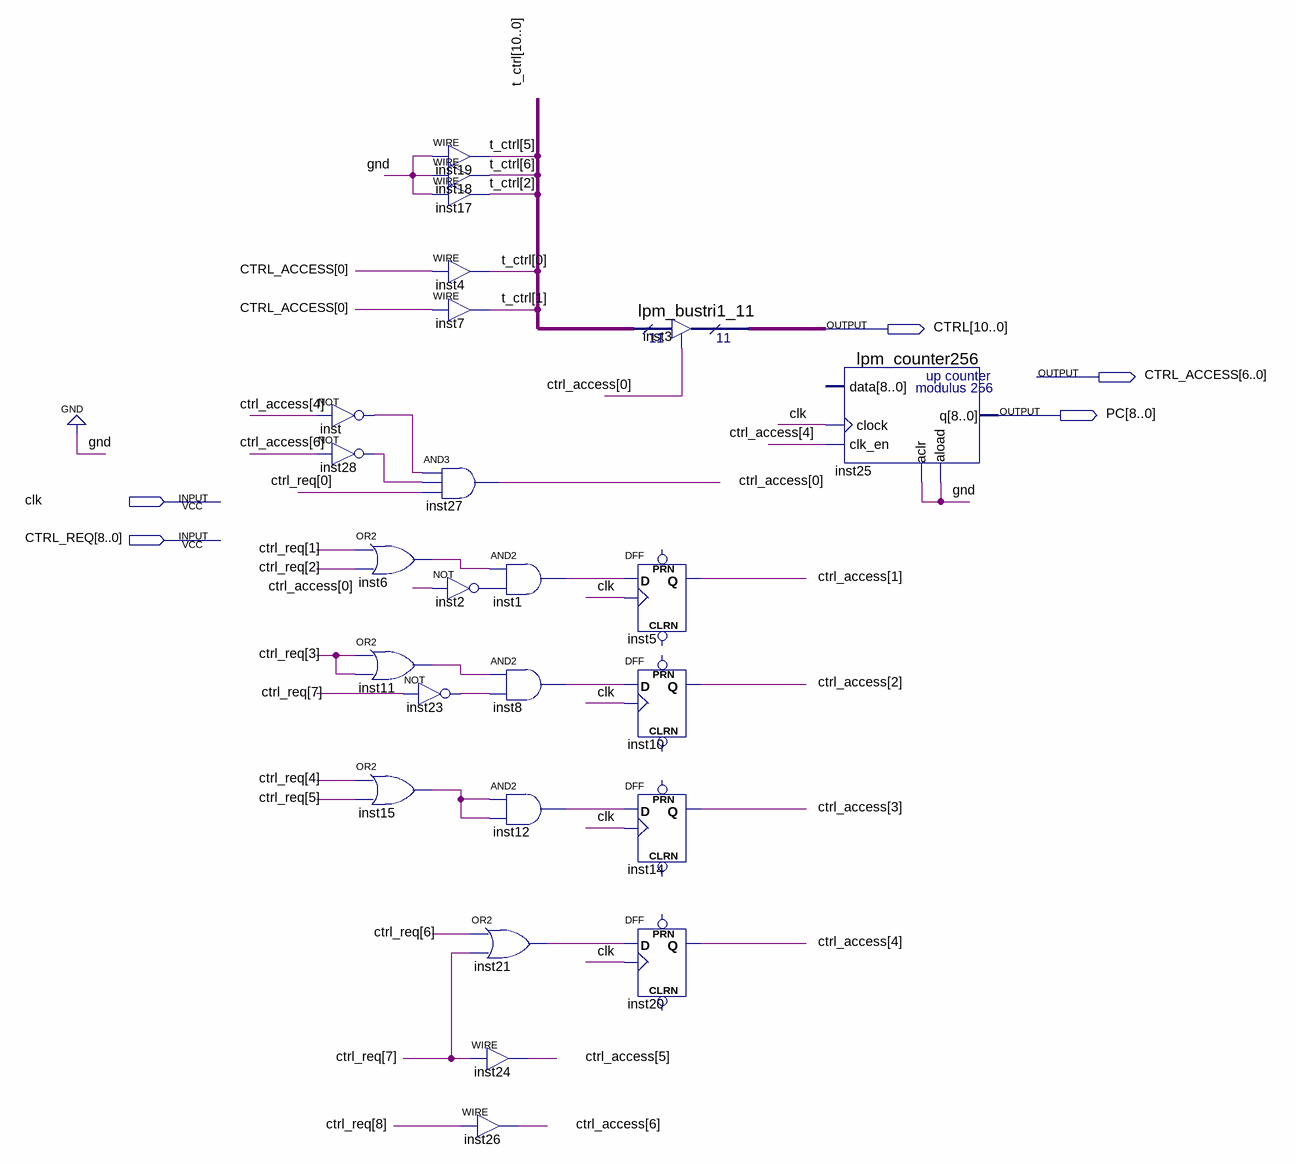
[diagram p0: schematic sheet]
// Quartus schematic CU.bdf as structural Verilog: 25 symbols, 5 pins
module CU (
  input  clk,
  input  [8:0] CTRL_REQ,
  output [10:0] CTRL,
  output [6:0] CTRL_ACCESS,
  output [8:0] PC
);

  wire inst1_out, inst2_out, inst6_out, inst8_out, inst11_out, inst12_out, inst15_out, inst21_out,
       inst23_out, inst28_out, inst_out;
  wire [10:0] t_ctrl;

  not inst (inst_out, CTRL_ACCESS[4]);
  not inst28 (inst28_out, CTRL_ACCESS[6]);
  or inst6 (inst6_out, CTRL_REQ[1], CTRL_REQ[2]);
  or inst11 (inst11_out, CTRL_REQ[3], CTRL_REQ[3]);
  or inst15 (inst15_out, CTRL_REQ[4], CTRL_REQ[5]);
  assign t_ctrl[5] = 1'b0;  // WIRE inst19
  assign t_ctrl[6] = 1'b0;  // WIRE inst18
  assign t_ctrl[2] = 1'b0;  // WIRE inst17
  assign t_ctrl[0] = CTRL_ACCESS[0];  // WIRE inst4
  assign t_ctrl[1] = CTRL_ACCESS[0];  // WIRE inst7
  and inst27 (CTRL_ACCESS[0], inst_out, inst28_out, CTRL_REQ[0]);
  not inst2 (inst2_out, CTRL_ACCESS[0]);
  not inst23 (inst23_out, CTRL_REQ[7]);
  and inst1 (inst1_out, inst6_out, inst2_out);
  and inst8 (inst8_out, inst11_out, inst23_out);
  and inst12 (inst12_out, inst15_out, inst15_out);
  or inst21 (inst21_out, CTRL_REQ[6], CTRL_REQ[7]);
  assign CTRL_ACCESS[5] = CTRL_REQ[7];  // WIRE inst24
  assign CTRL_ACCESS[6] = CTRL_REQ[8];  // WIRE inst26
  lpm_bustri1_11 inst3 (.enabledt(CTRL_ACCESS[0]), .data(t_ctrl), .tridata(CTRL));
  DFF inst5 (.CLK(clk), .D(inst1_out), .Q(CTRL_ACCESS[1]));  // open: CLRN, PRN
  DFF inst10 (.CLK(clk), .D(inst8_out), .Q(CTRL_ACCESS[2]));  // open: CLRN, PRN
  DFF inst14 (.CLK(clk), .D(inst12_out), .Q(CTRL_ACCESS[3]));  // open: CLRN, PRN
  DFF inst20 (.CLK(clk), .D(inst21_out), .Q(CTRL_ACCESS[4]));  // open: CLRN, PRN
  lpm_counter256 inst25 (.clock(clk), .clk_en(CTRL_ACCESS[4]), .aclr(1'b0), .aload(1'b0), .q(PC));  // open: data
endmodule
